# EAGLE design bird (EAGLE 7.1.0)
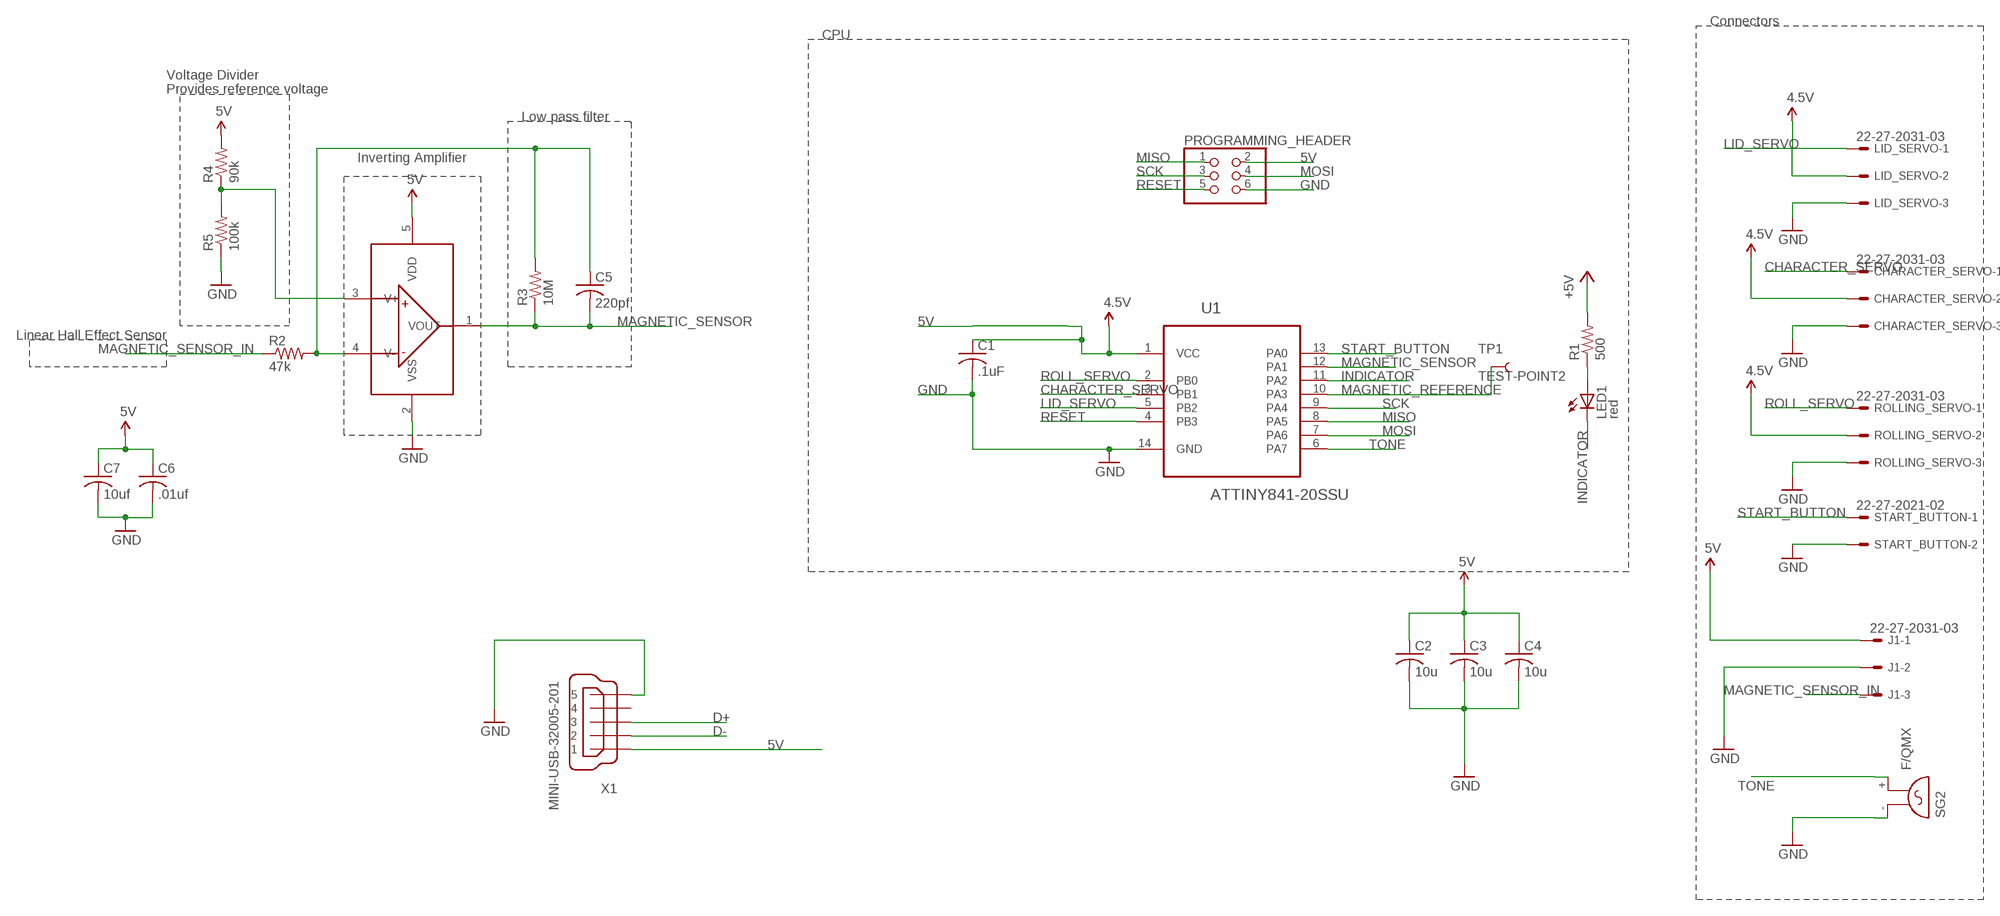
[diagram p0: schematic, sheet 1]

## Parts
C1  .1uF  C-USC0603  [C0603]
C2  10u  C-USC0805  [C0805]
C3  10u  C-USC0805  [C0805]
C4  10u  C-USC0805  [C0805]
C5  220pf  C-USC0603  [C0603]
C6  .01uf  C-USC0603  [C0603]
C7  10uf  C-USC0805  [C0805]
CHARACTER_SERVO  22-27-2031-03  [6410-03]
J1  22-27-2031-03  [6410-03]
LED1  red  LEDSML1206  [SML1206]
LID_SERVO  22-27-2031-03  [6410-03]
PROGRAMMING_HEADER  PINHD-2X3  [2X03]
R1  500  R-US_R0603  [R0603]
R2  47k  R-US_R0603  [R0603]
R3  10M  R-US_R0603  [R0603]
R4  90k  R-US_R0603  [R0603]
R5  100k  R-US_R0603  [R0603]
ROLLING_SERVO  22-27-2031-03  [6410-03]
SG2  F/QMX  [F/QMX]
START_BUTTON  22-27-2021-02  [6410-02]
TP1  TEST-POINT2  [PAD.02X.02]
U1  ATTINY841-20SSU  ATTINY84-20SSU  [SOIC127P600X175-14N]
U$5  MCP601  [SOT23-5]
X1  MINI-USB-32005-201  [32005-201]

## Nets
5V: C1.1 C2.1 C3.1 C4.1 C6.1 C7.1 CHARACTER_SERVO.2 J1.1 LID_SERVO.2 PROGRAMMING_HEADER.2 R1.2 R4.2 ROLLING_SERVO.2 U1.1(VCC) U$5.5(VDD) X1.1 ; supply symbol labelled 4.5V, +5V
CHARACTER_SERVO: CHARACTER_SERVO.1 U1.3(PB1)
D+: X1.3
D-: X1.2
GND: C1.2 C2.2 C3.2 C4.2 C6.2 C7.2 CHARACTER_SERVO.3 J1.2 LID_SERVO.3 PROGRAMMING_HEADER.6 R5.1 ROLLING_SERVO.3 SG2.- START_BUTTON.2 U1.14(GND) U$5.2(VSS) X1.5
INDICATOR: LED1.C U1.11(PA2)
LID_SERVO: LID_SERVO.1 U1.5(PB2)
MAGNETIC_REFERENCE: TP1.P$1 U1.10(PA3)
MAGNETIC_SENSOR: C5.2 R3.1 U1.12(PA1) U$5.1(VOUT)
MAGNETIC_SENSOR_IN: J1.3 R2.1
MISO: PROGRAMMING_HEADER.1 U1.8(PA5)
MOSI: PROGRAMMING_HEADER.4 U1.7(PA6)
N$1: LED1.A R1.1
N$4: C5.1 R2.2 R3.2 U$5.4(V-)
N$5: R4.1 R5.2 U$5.3(V+)
RESET: PROGRAMMING_HEADER.5 U1.4(PB3)
ROLL_SERVO: ROLLING_SERVO.1 U1.2(PB0)
SCK: PROGRAMMING_HEADER.3 U1.9(PA4)
START_BUTTON: START_BUTTON.1 U1.13(PA0)
TONE: SG2.+ U1.6(PA7)
Unconnected: X1.4

## Notes on the sheet
- Connectors
- CPU
- Voltage Divider
  Provides reference voltage
- Low pass filter
- Inverting Amplifier
- Linear Hall Effect Sensor

## Library data of the parts
C1-C7 = rcl:C-US: CAPACITOR, American symbol
CHARACTER_SERVO J1 LID_SERVO ROLLING_SERVO = con-molex:22-?-03: CONNECTOR wire to board 2.54 mm (.1 inch) pitch header; OC_FARNELL: unknown; OC_NEWARK: unknown
LED1 = led:LED: LED OSRAM: - CHIPLED LG R971, LG N971, LY N971, LG Q971, LY Q971, LO R971, LY R971 LH N974, LH R974 LS Q976, LO Q976, LY Q976 LO Q996 - Hyper CHIPLED LW Q18S LB Q993, LB Q99A, LB R99A - SideLED LS A670, LO A670, LY A670, LG A670, LP A670 LB A673, LV A673, LT A673, LW A673 LH A674 LY A675 LS A676, LA A676, LO A676, LY A676, LW A676 LS A679, LY A679, LG A679 - Hyper Micro SIDELED® LS Y876, LA Y876, LO Y876, LY Y876 LT Y87S - SmartLED LW L88C, LW L88S LB L89C, LB L89S, LG L890 LS L89K, LO L89K, LY L89K LS L896, LA L896, LO L896, LY L896 - TOPLED LS T670, LO T670, LY T670, LG T670, LP T670 LSG T670, LSP T670, LSY T670, LOP T670, LYG T670 LG T671, LOG T671, LSG T671 LB T673, LV T673, LT T673, LW T673 LH T674 LS T676, LA T676, LO T676, LY T676, LB T676, LH T676, LSB T676, LW T676 LB T67C, LV T67C, LT T67C, LS T67K, LO T67K, LY T67K, LW E67C LS E67B, LA E67B, LO E67B, LY E67B, LB E67C, LV E67C, LT E67C LW T67C LS T679, LY T679, LG T679 LS T770, LO T770, LY T770, LG T770, LP T770 LB T773, LV T773, LT T773, LW T773 LH T774 LS E675, LA E675, LY E675, LS T675 LS T776, LA T776, LO T776, LY T776, LB T776 LHGB T686 LT T68C, LB T68C - Hyper Mini TOPLED® LB M676 - Mini TOPLED Santana® LG M470 LS M47K, LO M47K, LY M47K Source: http://www.osram.convergy.de LUXEON: - LUMILED® LXK2-PW12-R00, LXK2-PW12-S00, LXK2-PW14-U00, LXK2-PW14-V00 LXK2-PM12-R00, LXK2-PM12-S00, LXK2-PM14-U00 LXK2-PE12-Q00, LXK2-PE12-R00, LXK2-PE12-S00, LXK2-PE14-T00, LXK2-PE14-U00 LXK2-PB12-K00, LXK2-PB12-L00, LXK2-PB12-M00, LXK2-PB14-N00, LXK2-PB14-P00, LXK2-PB14-Q00 LXK2-PR12-L00, LXK2-PR12-M00, LXK2-PR14-Q00, LXK2-PR14-R00 LXK2-PD12-Q00, LXK2-PD12-R00, LXK2-PD12-S00 LXK2-PH12-R00, LXK2-PH12-S00 LXK2-PL12-P00, LXK2-PL12-Q00, LXK2-PL12-R00 Source: www.luxeon.com KINGBRIGHT: KA-3528ASYC Source: www.kingbright.com
PROGRAMMING_HEADER = pinhead:PINHD-2X3: PIN HEADER
R1-R5 = rcl:R-US_: RESISTOR, American symbol
SG2 = buzzer:F/QMX: BUZZER Source: Buerklin; OC_FARNELL: unknown; OC_NEWARK: unknown
START_BUTTON = con-molex:22-?-02: CONNECTOR wire to board 2.54 mm (.1 inch) pitch header; OC_FARNELL: unknown; OC_NEWARK: unknown
TP1 = SparkFun:TEST-POINT
U1 = Atmel_By_element14_Batch_1-00:ATTINY84-20SSU: 8-bit Microcontroller with Bytes In-System Programmable Flash; MPN: ATTINY84-20SSU; OC_FARNELL: 1636955; OC_NEWARK: 03P2040; PACKAGE: SOIC-14; SUPPLIER: Atmel
U$5 = SparkFun:MCP601
X1 = con-cypressindustries:MINI-USB-: MINI USB-B Conector Source: www.cypressindustries.com; OC_FARNELL: unknown; OC_NEWARK: unknown

## Board
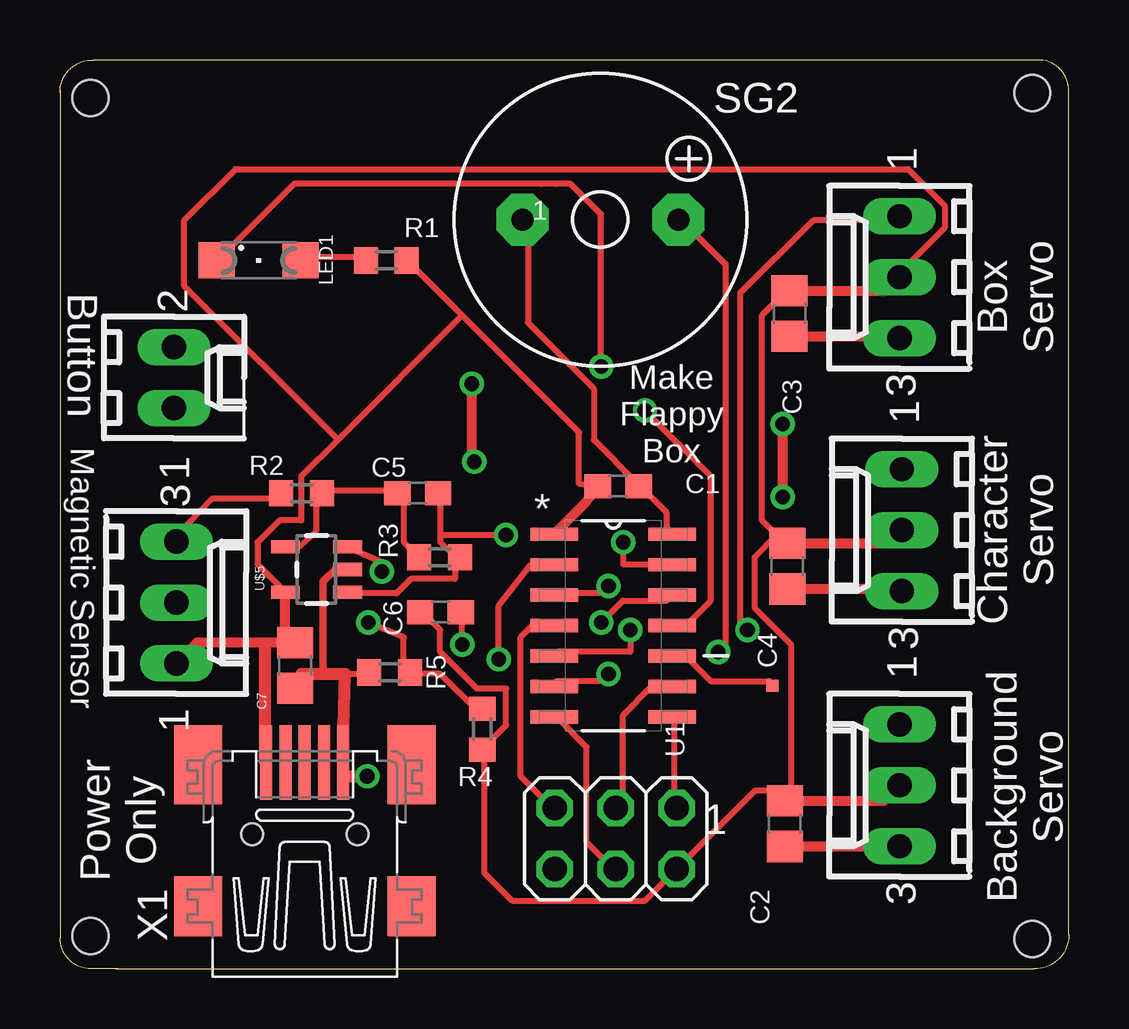
[diagram p1: board, top side]
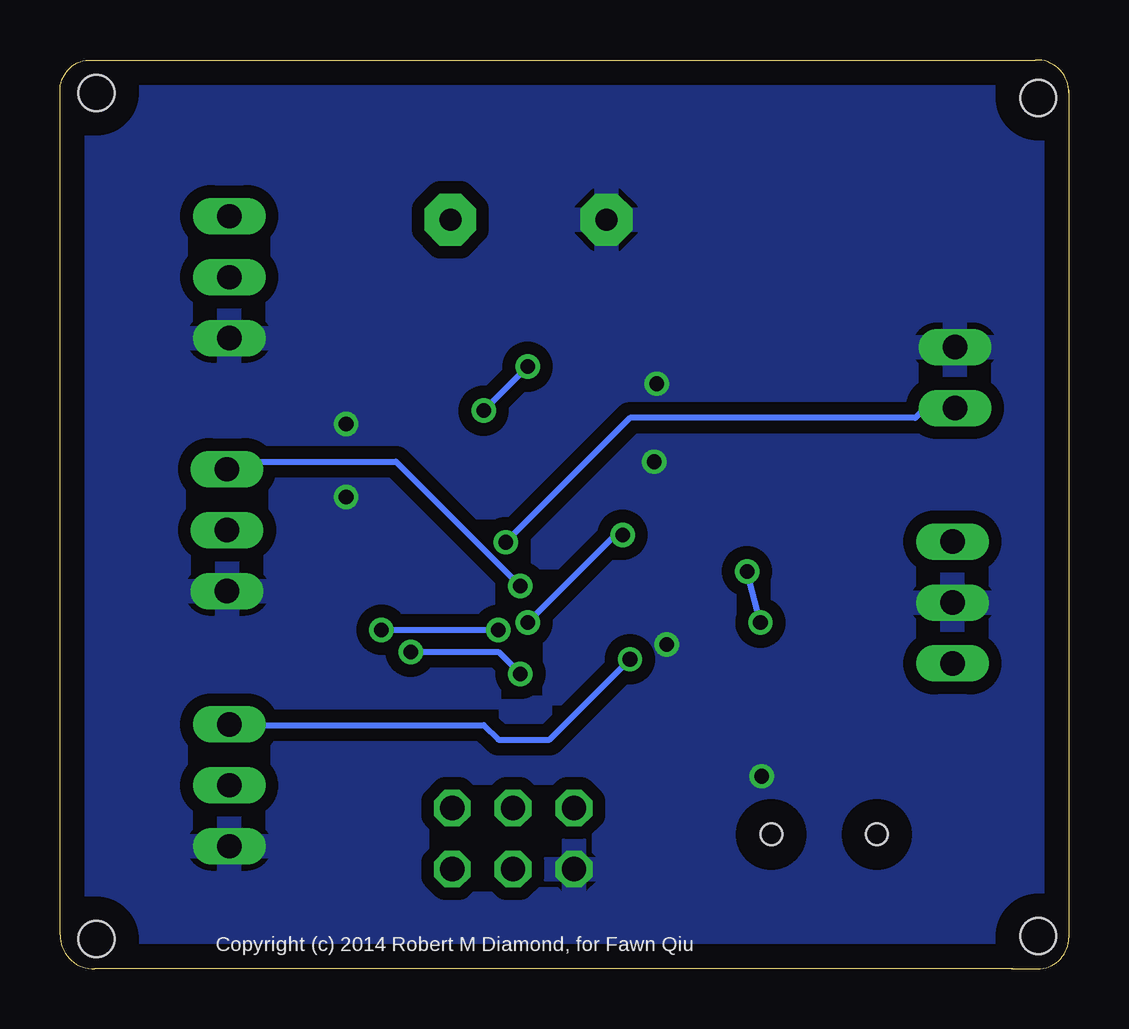
[diagram p2: board, bottom side, seen from below]

Size 42.05 x 37.87 mm. Coordinates in mm from the lower left corner, seen from the top.
Outline: 0,36.6 0,36.5
Outline: 0,36.5 0,2.2 0,1.3 arc90 1.3,0 2.3,0
Outline: 2.33,0 2.4,0
Outline: 2.4,0 40.6,0 arc92 42.05,1.41 42.05,36.57 arc94 40.73,37.87 1.39,37.87 arc93 0,36.5
Outline: 2.4,0 2.3,0
Outline: 2.3,0 2.2,0
Copper layers (1*16): Top 0.035mm / dielectric 1.5mm / Bottom 0.035mm
Design rules "default": minimum track width 10mil, minimum drill 24mil, track to track 8mil, track to pad 8mil, pad to pad 8mil, via to via 8mil, smd to smd 8mil, copper to edge 40mil, drill to drill 8mil, minimum pad ring 10mil, minimum via ring 8mil, stop-mask expansion 4mil, vias tented up to drill 0mil, thermal gap 10mil
Holes 1.5 mm at 1.27,1.37 1.27,36.3 40.53,36.5 40.53,1.24

### Footprints (pad centres in the part's own frame; a part is rotated, then mirrored left to right if it is on the bottom)
C0603 = smd 1.1 x 1: 1 -0.85,0; 2 0.85,0
C0805 = smd 1.3 x 1.5: 1 -0.95,0; 2 0.95,0
6410-03 = drill 1.016 long: 1 2.54,0; 2 0,0; 3 -2.54,0
SML1206 = smd 1.5 x 1.5: A 1.75,0; C -1.75,0
2X03 = drill 1.016 octagon: 1 -2.54,-1.27; 2 -2.54,1.27; 3 0,-1.27; 4 0,1.27; 5 2.54,-1.27; 6 2.54,1.27
R0603 = smd 1 x 1.1: 1 -0.85,0; 2 0.85,0
F/QMX = drill 0.914 pad 2.159 octagon: + 3.251,0; - -3.251,0
6410-02 = drill 1.016 long: 1 1.27,0; 2 -1.27,0
PAD.02X.02 = smd 0.508 x 0.508: P$1 0,0
SOIC127P600X175-14N = smd 1.981 x 0.559: 1 -2.464,3.81; 2 -2.464,2.54; 3 -2.464,1.27; 4 -2.464,0; 5 -2.464,-1.27; 6 -2.464,-2.54; 7 -2.464,-3.81; 8 2.464,-3.81; 9 2.464,-2.54; 10 2.464,-1.27; 11 2.464,0; 12 2.464,1.27; 13 2.464,2.54; 14 2.464,3.81
SOT23-5 = smd 0.55 x 1.2: 1 -0.95,-1.3; 2 0,-1.3; 3 0.95,-1.3; 4 0.95,1.3; 5 -0.95,1.3
32005-201 = smd 3.1 x 0.5: 1 3,1.6; 2 3,0.8; 3 3,0; 4 3,-0.8; 5 3,-1.6 | smd 2.5 x 2: M1 -3,-4.45; M2 -3,4.45 | smd 3.3 x 2: M3 2.9,4.45; M4 2.9,-4.45 | hole 0.9: 0,2.2; 0,-2.2

### Placement (x,y rotation side)
C1  23.27,20.12 0 top
C2  30.21,6.05 270 top
C3  30.41,27.31 270 top
C4  30.31,16.78 270 top
C5  14.91,19.82 0 top
C6  15.86,14.87 0 top
C7  9.8,12.64 270 top
CHARACTER_SERVO  35.09,18.28 90 top
J1  4.85,15.26 270 top
LED1  8.28,29.52 0 top
LID_SERVO  34.99,28.82 90 top
PROGRAMMING_HEADER  23.17,5.43 180 top
R1  13.6,29.52 0 top
R2  10.07,19.82 0 top
R3  15.82,17.15 180 top
R4  17.6,9.99 270 top
R5  13.75,12.36 0 top
ROLLING_SERVO  34.99,7.65 90 top
SG2  22.53,31.22 0 top
START_BUTTON  4.75,24.64 270 top
TP1  29.7,11.8 0 top
U1  23.06,14.3 0 top
U$5  10.69,16.64 90 top
X1  10.2,5.6 90 top

### Tracks (layer width: path | path; a pad name or v marks a point on that pad's centre or on a via)
5V
  Top 0.254: 29.87,18.08 30.18,17.78 C4.1 29.87,18.08 | 29.87,18.08 29.26,18.69 29.26,27.23 30.18,28.14 C3.1 | 29.87,18.08 28.96,17.17 28.96,15.04 30.48,13.51 30.48,7.11 C2.1 30.18,7.11 30.18,7.42 28.96,7.42 25.91,4.37 PROGRAMMING_HEADER.2 25.61,4.06 24.39,2.84 18.85,2.84 17.68,4.01 17.68,8.94 R4.2 17.68,9.24 18.6,10.16 18.6,11.68 17.38,11.68 15.85,13.21 15.85,14.12 15.24,14.73 C6.1 | 16.77,27.23 21.64,22.35 21.64,20.22 C1.1 | 16.77,27.23 14.63,29.36 R1.2 | 16.77,27.23 11.59,22.05 | 11.59,22.05 10.06,20.52 10.06,18.69 9.15,18.69 8.23,17.78 8.23,16.86 9.15,15.95 U$5.5 | 8.54,8.63 X1.1 | 8.54,13.51 8.54,13.59 | 11.59,22.05 5.19,28.45 5.19,31.19 7.32,33.32 7.42,33.32 35.36,33.32 36.88,31.8 36.88,30.89 35.05,29.06 LID_SERVO.2
  Top 0.406: C3.1 34.43,28.26 LID_SERVO.2 | C4.1 34.54,17.73 CHARACTER_SERVO.2 | C2.1 34.34,7 ROLLING_SERVO.2 | J1.1 5.71,13.59 8.54,13.59 C7.1 9.39,14 U$5.5 | C1.1 21.87,19.38 U1.1
  Top 0.508: 8.54,13.51 8.54,8.63
CHARACTER_SERVO  (via drill 0.61)
  Top 0.254: v22.86,15.95 22.86,15.64 20.73,15.64 U1.3
  Bottom 0.254: v22.86,15.95 28.05,21.13 34.75,21.13 35.05,20.83 CHARACTER_SERVO.1
GND  (via drill 0.61)
  Top 0.254: 11.89,12.29 12.8,12.29 R5.1 | 10.06,12.29 10.06,11.99 C7.2 | 11.48,16.64 U$5.2 | v16.77,13.51 16.77,14.73 C6.2 | 11.89,8.03 11.89,8.33 X1.5 11.79,8.63 | U1.14 25.3,18.39 25.3,19 24.39,19.91 C1.2 24.08,20.22 22.25,22.05 22.25,24.18 19.51,26.92 19.51,30.99 SG2.-
  Top 0.305: 11.48,16.64 10.98,16.15 10.98,12.29
  Top 0.406: C3.2 34.91,26.36 LID_SERVO.3 | C4.2 35,15.83 CHARACTER_SERVO.3 | C2.2 ROLLING_SERVO.3 | v30.13,19.66 v30.13,22.7 v30.13,22.71 | v17.27,21.13 17.17,21.13 v17.17,24.38
  Top 0.508: 10.06,12.29 10.98,12.29 11.89,12.29 11.79,8.63 | 11.89,8.03 v12.8,8.03
  pour Bottom (isolate 0.533, rank 6): 0.64,36.93 41.23,37.13 41.18,0.21 1.19,0.46
INDICATOR  (via drill 0.61)
  Top 0.254: v22.56,25.09 22.56,31.44 21.29,32.71 20.68,32.71 20.07,32.71 9.76,32.71 6.71,29.67 LED1.C | v24.39,23.27 27.13,20.52 27.13,15.34 26.22,14.43 25.61,14.43 U1.11
  Bottom 0.254: v24.39,23.27 v22.56,25.09
LID_SERVO  (via drill 0.61)
  Top 0.254: v23.78,14.12 23.78,13.21 20.73,13.21 U1.5 | v28.65,14.12 28.35,14.43 28.35,28.14 31.4,31.19 34.75,31.19 LID_SERVO.1
  Bottom 0.254: v28.65,14.12 v23.78,14.12
MAGNETIC_REFERENCE
  Top 0.254: TP1.P$1 29.57,11.99 27.13,11.99 26.22,12.9 25.61,12.9 U1.10
MAGNETIC_SENSOR  (via drill 0.61)
  Top 0.254: 15.85,18.08 15.85,19.61 C5.2 | 15.85,18.08 15.85,17.78 16.46,17.17 R3.1 16.46,16.86 16.46,16.25 14.63,16.25 14.02,15.64 12.2,15.64 U$5.1 | v22.56,14.43 23.47,15.34 25.3,15.34 U1.12 | 15.85,18.08 v18.6,18.08
  Bottom 0.254: v22.56,14.43 18.9,18.08 v18.6,18.08
MAGNETIC_SENSOR_IN
  Top 0.254: R2.1 9.15,19.61 6.35,19.61 4.88,18.08 J1.3
MISO
  Top 0.254: U1.8 25.61,10.46 25.61,6.81 PROGRAMMING_HEADER.1
MOSI
  Top 0.254: U1.7 20.73,10.46 21.95,9.24 21.95,5.28 22.86,4.37 PROGRAMMING_HEADER.4
N$1
  Top 0.254: R1.1 12.5,29.67 10.06,29.67 LED1.A
N$4
  Top 0.254: R3.2 14.94,17.17 14.33,17.78 14.33,19.61 C5.1 14.02,19.91 10.98,19.91 R2.2 10.67,19.61 10.67,18.24 9.97,17.59 U$5.4
N$5  (via drill 0.61)
  Top 0.254: R4.1 17.38,10.77 15.85,12.29 14.63,12.29 R5.2 14.33,12.6 14.33,13.82 v12.86,14.43 | v13.41,16.56 13.36,16.97 12.2,17.47 U$5.3
  Bottom 0.254: v12.86,14.43 v13.41,16.56
RESET
  Top 0.254: U1.4 19.68,14.3 19.21,13.82 19.21,8.03 20.43,6.81 PROGRAMMING_HEADER.5
ROLL_SERVO  (via drill 0.61)
  Top 0.254: v18.29,12.9 18.29,15.14 19.62,16.84 U1.2
  Bottom 0.254: v18.29,12.9 21.64,9.55 23.78,9.55 24.39,10.16 34.75,10.16 ROLLING_SERVO.1
SCK
  Top 0.254: U1.9 24.62,11.76 23.47,10.56 23.47,7.11 23.17,6.81 PROGRAMMING_HEADER.3
START_BUTTON  (via drill 0.61)
  Top 0.254: v23.47,17.78 23.47,16.86 25.3,16.86 U1.13
  Bottom 0.254: v23.47,17.78 18.29,22.96 6.4,22.96 6.1,23.27 4.88,23.27 START_BUTTON.1
TONE  (via drill 0.61)
  Top 0.254: v22.86,12.29 22.86,11.99 20.73,11.99 U1.6 | v27.43,13.21 27.74,13.51 27.74,29.36 25.91,31.19 SG2.+
  Bottom 0.254: v22.86,12.29 23.78,13.21 v27.43,13.21

### Text on the board
tNames: 1 | Box / Servo | Button | Magnetic Sensor | Make / Flappy / Box | Character / Servo | Background / Servo | Power / Only | 1
bNames: Copyright (c) 2014 Robert M Diamond, for Fawn Qiu
180bmp: /Users/rmd/Downloads/flappy.bmp
230bmp: /Users/rmd/Downloads/flappy.bmp